# Altium schematic sheet Input Connections.SchDoc
size 420 x 297 mm; SheetNumber: 6; SheetTotal: 6
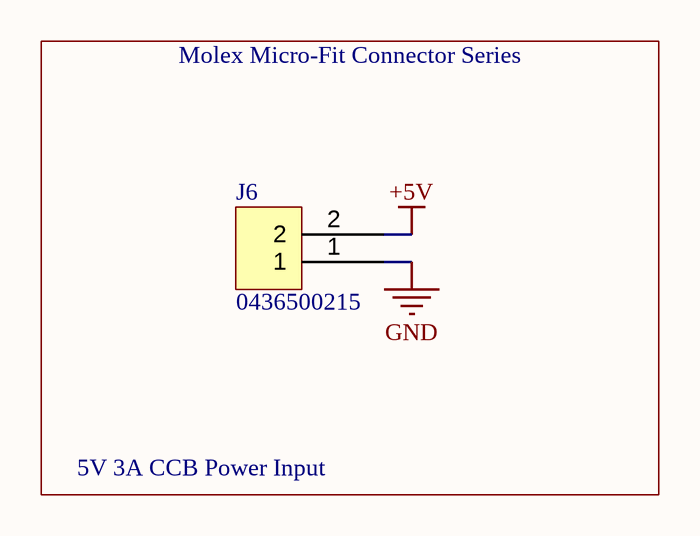
[diagram p0: Input Connections.SchDoc]

## Parts
J6  0436500215  [0436500215-Footprint-1]

## Nets
+5V: J6.2
GND: J6.1

## Notes on the sheet
- Molex Micro-Fit Connector Series
- 5V 3A CCB Power Input
- THIS DOCUMENT AND THE DATA DISCLOSED HEREIN OR
- HEREWITH IS THE PROPERTY OF ALTIUM LIMITED AND MAY
- DWG NO:
- REVISION
- REV:
- DESCRIPTION
- DATE
- APPROVED
- BE FREELY DISTRIBUTED IN WHOLE. NO RIGHTS ARE
- RESERVED OR EXPRESS OR IMPLIED WARANTEE GIVEN.
- ENG:
- APPROVALS
- PROJECT
- DSN:
- CHK:
- REFERENCE DOCUMENTS
- PROJECT REVISION:
- TITLE
- DOCUMENT REVISION:
- DESIGN ITEM:
- BOM:
- FAB DWG:
- PCB DWG:
- ASSY DWG:
- SCALE:
- A3
- SIZE
- CAGE CODE
- FILE NAME
- DWG NO.
- SHEET
- OF
- REV

## Library data of the parts
J6 = CMP-00008-2: Header 1 Row Vertical Polarizing Peg 2 Pin SMT/Glow Wire Compatible Tin Plate; Number of Positions: 2; Max Voltage Rating (DC): 250V; Number of Ports: 1; Pitch: 3mm; Contact Resistance: 30mR; Connector Type: Male Pin; Mount: Through Hole; Depth: 5.57mm; Series: Micro-Fit 3.0™ 43650; Housing Material: Polymer; Max Operating Temperature: 105°C; Fastening Type: Ramp; Color: Black; Length: 9.65mm; Contact Plating: Tin; Number of Rows: 1; Housing Color: Black; RoHS Compliant: Yes; Orientation: Straight; Packaging: Tray; Number of Contacts: 2; Termination: Solder; Contact Material: Brass; Max Voltage Rating (AC): 250V; Min Operating Temperature: -40°C; Number of Terminals/Pins: 2; Contact Type: Male Pin